# Altium schematic sheet ET-UARTPmod.SchDoc
size A4
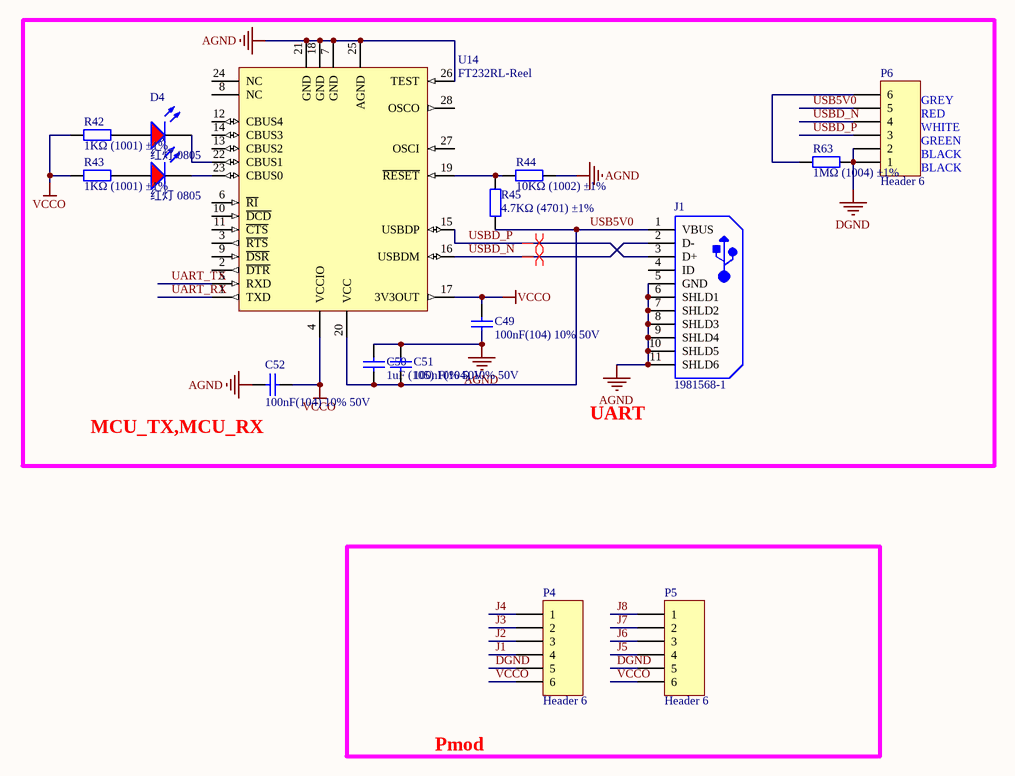
[diagram p0: ET-UARTPmod.SchDoc]

## Parts
C49  100nF(104) 10% 50V  [LC-0805_C]
C50  1uF (105) 10% 50V  [LC-0805_C]
C51  100nF(104) 10% 50V  [LC-0805_C]
C52  100nF(104) 10% 50V  [LC-0805_C]
D4  红灯 0805  [LC-0805_LED_S1]
D5  红灯 0805  [LC-0805_LED_S1]
J1  1981568-1  [TECO-1981568-5_V]
P4  Header 6  [HDR1X6]
P5  Header 6  [HDR1X6]
P6  Header 6  [HDR1X6]
R42  1KΩ (1001) ±1%  [LC-0805_R]
R43  1KΩ (1001) ±1%  [LC-0805_R]
R44  10KΩ (1002) ±1%  [LC-0805_R]
R45  4.7KΩ (4701) ±1%  [LC-0805_R]
R63  1MΩ (1004) ±1%  [LC-0805_R]
U14  FT232RL-Reel  [SSOP-28_N]

## Blocks framed on the sheet
Pmod: P4 P5

## Nets
AGND: C49.2 C50.1 C51.1 C52.1 J1.5(GND) J1.6(SHLD1) J1.7(SHLD2) J1.8(SHLD3) J1.9(SHLD4) J1.10(SHLD5) J1.11(SHLD6) R44.1 U14.7(GND) U14.18(GND) U14.21(GND) U14.25(AGND) U14.26(TEST)
DGND: P4.5 P5.5 P6.1 P6.2 R63.2
VCCO: C49.1 C52.2 P4.6 P5.6 R42.2 R43.2 U14.4(VCCIO) U14.17(3V3OUT)
J1: P4.4
J2: P4.3
J3: P4.2
J4: P4.1
J5: P5.4
J6: P5.3
J7: P5.2
J8: P5.1
UART_RX: U14.1(TXD)
UART_TX: U14.5(RXD)
USB5V0: C50.2 C51.2 J1.1(VBUS) P6.5 R45.2 U14.20(VCC)
USBD_N: J1.2(D-) P6.4 U14.16(USBDM)
USBD_P: J1.3(D+) P6.3 U14.15(USBDP)
NetD4_A: D4.A R42.1
NetD4_K: D4.K U14.22(CBUS1)
NetD5_A: D5.A R43.1
NetD5_K: D5.K U14.23(CBUS0)
NetP6_6: P6.6 R63.1
NetR44_2: R44.2 R45.1 U14.19(~{RESET})

Not connected (* = marked no-connect by the designer): J1 4(ID); U14 2(~{DTR}) 3(~{RTS}) 6(~{RI}) 8(NC) 9(~{DSR}) 10(~{DCD}) 11(~{CTS}) 12(CBUS4) 13(CBUS2) 14(CBUS3) 24(NC) 27(OSCI) 28(OSCO)

## Layout directives
differential pair: USBD_N, USBD_P

## Notes on the sheet
- MCU_TX,MCU_RX
- UART
- Labels drawn without touching a wire or pin: BLACK, GREEN, GREY, RED, WHITE

## Library data of the parts
C49 C51 C52 = 0805 100nF(104) 10% 50V: 贴片电容; ComponentLink1Description: 供应商链接; ComponentLink1URL: http://www.szlcsc.com/product/details_50686.html; Package: 0805; Supplier: LC; SuppliersPartNumber: C49678
C50 = 0805 1uF (105) 10% 50V: 贴片电容; ComponentLink1Description: 供应商链接; ComponentLink1URL: http://www.szlcsc.com/product/details_29074.html; Package: 0805; Supplier: LC; SuppliersPartNumber: C28323
D4 D5 = 0805 红灯: 发光二极管; ComponentLink1Description: 供应商链接; ComponentLink1URL: http://www.szlcsc.com/product/details_2668.html; Package: 0805; Supplier: LC; SuppliersPartNumber: C2295
J1 = 1981568-1: Micro USB Receptacle Standard Type B Assy, 5-Pin SMD, RoHS, Tape and Reel; Number of Contacts: 5 POS; Number of Ports: 1 Port; Product Length (mm): 8 mm; Gender: RCP; Current Rating (Max): 1/Contact A; Voltage Rating Max: 30VAC; Body Orientation: Right Angle; Product Depth (mm): 5.6 mm; Pitch (mm): 0.65 mm; Product Height (mm): 3 mm; DatasheetVersion: Rev. E2; PackageReference: SMD; PackageDescription: SMD, 5-Leads, Body 8x5.9mm, Pitch 0.65mm; Supplier 1: Digi-Key; Supplier Part Number 1: A97800TR-ND; Supplier 2: Digi-Key; Supplier Part Number 2: A97800CT-ND; Supplier 3: Digi-Key; Supplier Part Number 3: A97800DKR-ND; Termination Method: Solder; Operating Temperature Min Deg. C: -55C; Operating Temperature Max Deg. C: 85C; Number of Terminals: 5; Mounting Style: Surface Mount; Packaging: Tape and Reel; Housing Material: Thermoplastic; Contact Plating: Gold Over Nickel; Type: Micro USB; Contact Material: Copper Alloy; Operating Temp Range: -55C to 85C; ComponentLink1Description: Manufacturer URL; ComponentLink1URL: http://www.te.com; ComponentLink2Description: Datasheet; ComponentLink2URL: http://www.mouser.com/ds/2/418/NG_CD_1981568_E2-621296.pdf
P4-P6 = Header 6: Header, 6-Pin; LatestRevisionDate: 17-Jul-2002; LatestRevisionNote: Re-released for DXP Platform.; Publisher: Altium Limited
R42 R43 = 0805 1KΩ (1001) 1%: 贴片电阻; ComponentLink1Description: 供应商链接; ComponentLink1URL: http://www.szlcsc.com/product/details_18201.html; Package: 0805; Supplier: LC; SuppliersPartNumber: C17513
R44 = 0805 10KΩ (1002) 1%: 贴片电阻; ComponentLink1Description: 供应商链接; ComponentLink1URL: http://www.szlcsc.com/product/details_18102.html; Package: 0805; Supplier: LC; SuppliersPartNumber: C17414
R45 = 0805 4.7KΩ (4701) 1%: 贴片电阻; ComponentLink1Description: 供应商链接; ComponentLink1URL: http://www.szlcsc.com/product/details_18361.html; Package: 0805; Supplier: LC; SuppliersPartNumber: C17673
R63 = 0805 1MΩ (1004) 1%: 贴片电阻; ComponentLink1Description: 供应商链接; ComponentLink1URL: http://www.szlcsc.com/product/details_18202.html; Package: 0805; Supplier: LC; SuppliersPartNumber: C17514
U14 = FT232RL-Reel: USB UART Asynchronous Serial Data Transfer Chip, SSOP-28, Tape and Reel; Published: 19-Aug-2010; DatasheetVersion: ver 2.07, Jul-2010; PackageVersion: 2010; PackageReference: SSOP-28; Publisher: Altium Limited; PackageDescription: 28-Pin Small Outline Package 0.65 mm Pitch; ComponentLink1Description: Manufacturer Link; ComponentLink1URL: http://www.ftdichip.com/Products/ICs/FT232R.htm; ComponentLink2Description: Datasheet; ComponentLink2URL: http://www.ftdichip.com/Support/Documents/DataSheets/ICs/DS_FT232R.pdf